# Altium project MotorDriverBoard.PrjPcb
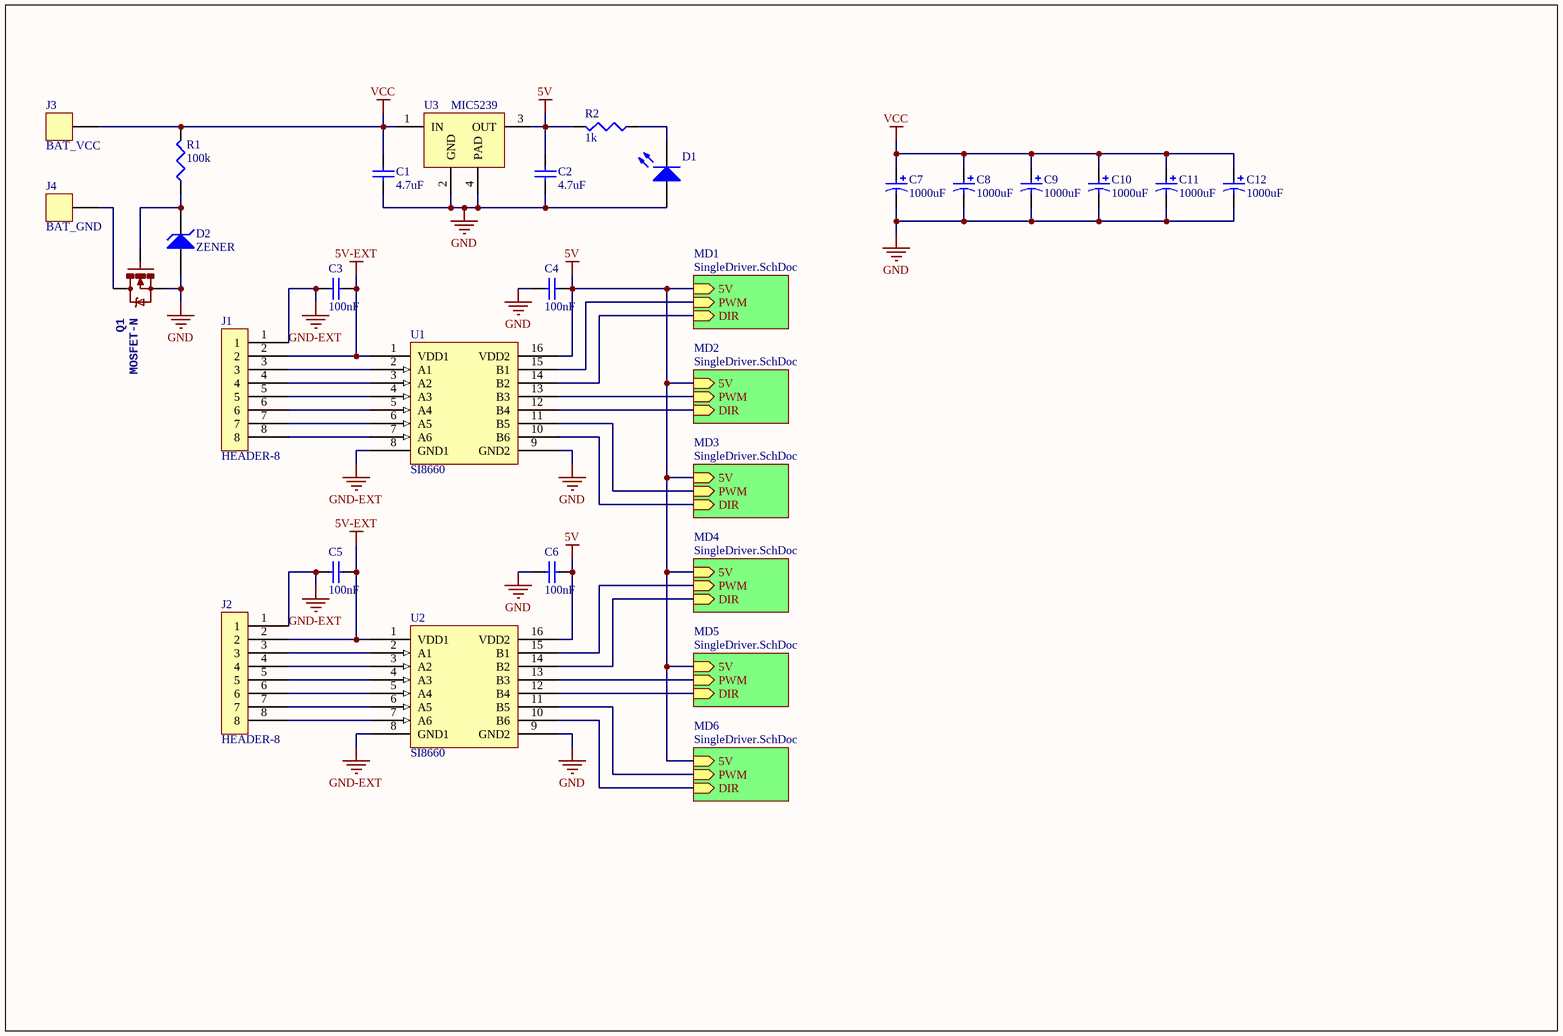
[diagram p0: MotorDrivers.SchDoc]
2 sheets, 192 parts. Net scope: hierarchical (ports join the sheet entries above them; power ports are global).
Board file: MotorDriverBoard.PcbDoc
Sheets:
  MotorDrivers.SchDoc
    MD1 = SingleDriver.SchDoc
    MD2 = SingleDriver.SchDoc
    MD3 = SingleDriver.SchDoc
    MD4 = SingleDriver.SchDoc
    MD5 = SingleDriver.SchDoc
    MD6 = SingleDriver.SchDoc

## Sheet MotorDrivers.SchDoc
size A4

### Parts
C1  4.7uF  [C1206]
C2  4.7uF  [C1206]
C3  100nF  [1608[0603]]
C4  100nF  [1608[0603]]
C5  100nF  [1608[0603]]
C6  100nF  [1608[0603]]
C7  1000uF  [cap_radial_20]
C8  1000uF  [cap_radial_20]
C9  1000uF  [cap_radial_20]
C10  1000uF  [cap_radial_20]
C11  1000uF  [cap_radial_20]
C12  1000uF  [cap_radial_20]
D1  LED2  [1608[0603]]  (value not drawn)
D2  ZENER  [SODFL370X135-2N]
J1  HEADER-8  [MICRO-MATCH-8]
J2  HEADER-8  [MICRO-MATCH-8]
J3  BAT_VCC  [HIGH-POWER-VIA]
J4  BAT_GND  [HIGH-POWER-VIA]
Q1  MOSFET-N  [SOT669]
R1  100k  [J1-0603]
R2  1k  [J1-0603]
U1  SI8660  [SOIC16]
U2  SI8660  [SOIC16]
U3  MIC5239  [SOT230P700X180-4N]

### Sub-sheets
MD1 = SingleDriver.SchDoc: 5V (in), PWM (in), DIR (in)
MD2 = SingleDriver.SchDoc: 5V (in), PWM (in), DIR (in)
MD3 = SingleDriver.SchDoc: 5V (in), PWM (in), DIR (in)
MD4 = SingleDriver.SchDoc: 5V (in), PWM (in), DIR (in)
MD5 = SingleDriver.SchDoc: 5V (in), PWM (in), DIR (in)
MD6 = SingleDriver.SchDoc: 5V (in), PWM (in), DIR (in)

### Nets
5V: C2.2 C4.1 C6.1 R2.2 U1.16(VDD2) U2.16(VDD2) U3.3(OUT) ; sheet MD1/5V, sheet MD2/5V, sheet MD3/5V, sheet MD4/5V, sheet MD5/5V, sheet MD6/5V
5V-EXT: C3.1 C5.1 J1.2 J2.2 U1.1(VDD1) U2.1(VDD1)
GND: C1.1 C2.1 C4.2 C6.2 C7.1 C8.1 C9.1 C10.1 C11.1 C12.1 D1.1(A) D2.2 Q1.S U1.9(GND2) U2.9(GND2) U3.2(GND) U3.4(PAD)
GND-EXT: C3.2 C5.2 J1.1 J2.1 U1.8(GND1) U2.8(GND1)
VCC: C1.2 C7.2 C8.2 C9.2 C10.2 C11.2 C12.2 J3.1 R1.2 U3.1(IN)
NetD1_2: D1.2(K) R2.1
NetD2_1: D2.1 Q1.G R1.1
NetJ1_3: J1.3 U1.2(A1)
NetJ1_4: J1.4 U1.3(A2)
NetJ1_5: J1.5 U1.4(A3)
NetJ1_6: J1.6 U1.5(A4)
NetJ1_7: J1.7 U1.6(A5)
NetJ1_8: J1.8 U1.7(A6)
NetJ2_3: J2.3 U2.2(A1)
NetJ2_4: J2.4 U2.3(A2)
NetJ2_5: J2.5 U2.4(A3)
NetJ2_6: J2.6 U2.5(A4)
NetJ2_7: J2.7 U2.6(A5)
NetJ2_8: J2.8 U2.7(A6)
NetJ4_1: J4.1 Q1.D
NetU1_10: U1.10(B6) ; sheet MD3/DIR
NetU1_11: U1.11(B5) ; sheet MD3/PWM
NetU1_12: U1.12(B4) ; sheet MD2/DIR
NetU1_13: U1.13(B3) ; sheet MD2/PWM
NetU1_14: U1.14(B2) ; sheet MD1/DIR
NetU1_15: U1.15(B1) ; sheet MD1/PWM
NetU1_MD4_19: U2.14(B2) ; sheet MD4/DIR
NetU1_MD4_22: U2.15(B1) ; sheet MD4/PWM
NetU1_MD5_19: U2.12(B4) ; sheet MD5/DIR
NetU1_MD5_22: U2.13(B3) ; sheet MD5/PWM
NetU1_MD6_19: U2.10(B6) ; sheet MD6/DIR
NetU1_MD6_22: U2.11(B5) ; sheet MD6/PWM

### Library data of the parts
C1-C6 = Cap Semi: Capacitor (Semiconductor SIM Model); Value: 100pF; Published: 8-Jun-2000; LatestRevisionDate: 29-May-2009; LatestRevisionNote: IPC-7351 Footprint Added.; PackageReference: C1206; Publisher: Altium Limited; PackageDescription: Chip Capacitor
C7-C12 = cap_pol
D1 = LED2: Typical RED, GREEN, YELLOW, AMBER GaAs LED; Published: 8-Jun-2000; LatestRevisionDate: 17-Jul-2002; LatestRevisionNote: Re-released for DXP Platform.; PackageVersion: Feb-2002; PackageReference: 3.2X1.6X1.1; Publisher: Altium Limited; PackageDescription: SM LED; 2 Flat Leads
D2 = ZENER-DIODE
J3 J4 = HEADER-1
Q1 = MOSFET-N: PROD_ID: IC-08089
R1 = Res3: Resistor; Value: 1K; Published: 8-Jun-2000; LatestRevisionDate: 29-May-2009; LatestRevisionNote: IPC-7351 Footprint Added.; PackageReference: J1-0603; Publisher: Altium Limited; PackageDescription: Chip Resistor
R2 = Res3: Resistor; Published: 8-Jun-2000; LatestRevisionDate: 29-May-2009; LatestRevisionNote: IPC-7351 Footprint Added.; PackageReference: J1-0603; Publisher: Altium Limited; PackageDescription: Chip Resistor; Value: 1K

## Sheet SingleDriver.SchDoc
size A4
Used 6 times, as channels MD1, MD2, MD3, MD4, MD5, MD6. Parts and nets are listed once, with the designators drawn on the sheet.
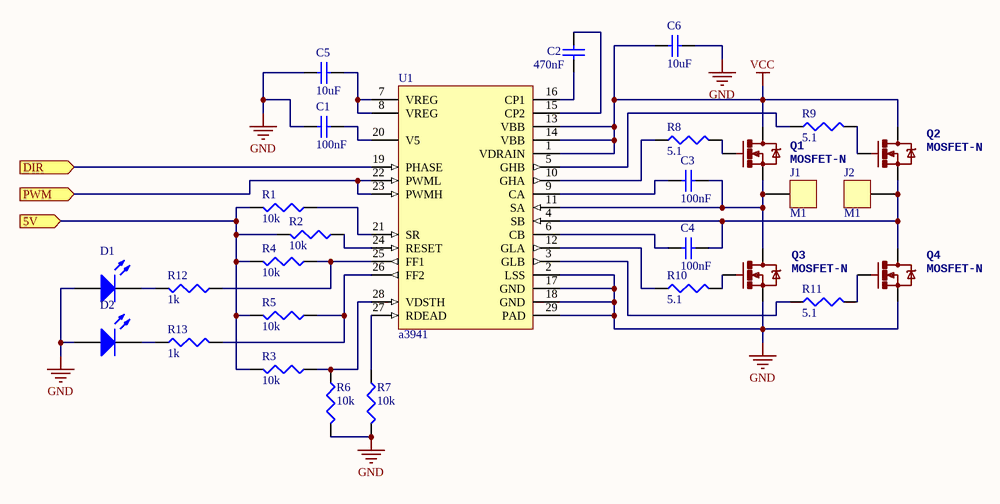
[diagram p1: SingleDriver.SchDoc]

### Parts
C1  100nF  [1608[0603]]
C2  470nF  [1608[0603]]
C3  100nF  [1608[0603]]
C4  100nF  [1608[0603]]
C5  10uF  [C1206]
C6  10uF  [C1206]
D1  LED2  [1608[0603]]  (value not drawn)
D2  LED2  [1608[0603]]  (value not drawn)
J1  M1  [POWER-VIA]
J2  M1  [POWER-VIA]
Q1  MOSFET-N  [SOT669]
Q2  MOSFET-N  [SOT669]
Q3  MOSFET-N  [SOT669]
Q4  MOSFET-N  [SOT669]
R1  10k  [J1-0603]
R2  10k  [J1-0603]
R3  10k  [J1-0603]
R4  10k  [J1-0603]
R5  10k  [J1-0603]
R6  10k  [J1-0603]
R7  10k  [J1-0603]
R8  5.1  [J1-0603]
R9  5.1  [J1-0603]
R10  5.1  [J1-0603]
R11  5.1  [J1-0603]
R12  1k  [J1-0603]
R13  1k  [J1-0603]
U1  a3941  [TSSOP28]

### Ports
5V (in), DIR (in), PWM (in)

### Nets
GND: C1.1 C5.1 C6.2 D1.1(A) D2.1(A) Q3.S Q4.S R6.2 R7.2 U1.2(LSS) U1.17(GND) U1.18(GND) U1.29(PAD)
VCC: C6.1 Q1.D Q2.D U1.1(VDRAIN) U1.13(VBB) U1.14(VBB)
5V: R1.2 R2.2 R3.2 R4.2 R5.2 ; port 5V
DIR: U1.19(PHASE) ; port DIR
PWM: U1.22(PWML) U1.23(PWMH) ; port PWM
NetC1_2: C1.2 U1.20(V5)
NetC2_1: C2.1 U1.16(CP1)
NetC2_2: C2.2 U1.15(CP2)
NetC3_1: C3.1 U1.9(CA)
NetC3_2: C3.2 J1.1 Q1.S Q3.D U1.11(SA)
NetC4_1: C4.1 U1.6(CB)
NetC4_2: C4.2 J2.1 Q2.S Q4.D U1.4(SB)
NetC5_2: C5.2 U1.7(VREG) U1.8(VREG)
NetD1_2: D1.2(K) R12.2
NetD2_2: D2.2(K) R13.1
NetQ1_G: Q1.G R8.2
NetQ2_G: Q2.G R9.2
NetQ3_G: Q3.G R10.2
NetQ4_G: Q4.G R11.2
NetR1_1: R1.1 U1.21(SR)
NetR2_1: R2.1 U1.24(RESET)
NetR3_1: R3.1 R6.1 U1.28(VDSTH)
NetR4_1: R4.1 R12.1 U1.25(FF1)
NetR5_1: R5.1 R13.2 U1.26(FF2)
NetR7_1: R7.1 U1.27(RDEAD)
NetR8_1: R8.1 U1.10(GHA)
NetR9_1: R9.1 U1.5(GHB)
NetR10_1: R10.1 U1.12(GLA)
NetR11_1: R11.1 U1.3(GLB)

### Channels
MD1: designators end in _MD1; ports 5V=5V DIR=NetU1_14 PWM=NetU1_15
MD2: designators end in _MD2; ports 5V=5V DIR=NetU1_12 PWM=NetU1_13
MD3: designators end in _MD3; ports 5V=5V DIR=NetU1_10 PWM=NetU1_11
MD4: designators end in _MD4; ports 5V=5V DIR=NetU1_MD4_19 PWM=NetU1_MD4_22
MD5: designators end in _MD5; ports 5V=5V DIR=NetU1_MD5_19 PWM=NetU1_MD5_22
MD6: designators end in _MD6; ports 5V=5V DIR=NetU1_MD6_19 PWM=NetU1_MD6_22

### Library data of the parts
C1-C6 = Cap Semi: as C1 on sheet MotorDrivers; Published: 8-Jun-2000; LatestRevisionDate: 29-May-2009; LatestRevisionNote: IPC-7351 Footprint Added.; PackageReference: C1206; Publisher: Altium Limited; PackageDescription: Chip Capacitor
D1 D2 = LED2: as D1 on sheet MotorDrivers; Published: 8-Jun-2000; LatestRevisionDate: 17-Jul-2002; LatestRevisionNote: Re-released for DXP Platform.; PackageVersion: Feb-2002; PackageReference: 3.2X1.6X1.1; Publisher: Altium Limited; PackageDescription: SM LED; 2 Flat Leads
J1 J2 = HEADER-1
Q1-Q4 = MOSFET-N: PROD_ID: IC-08089
R1-R11 = Res3: Resistor; Value: 1K; Published: 8-Jun-2000; LatestRevisionDate: 29-May-2009; LatestRevisionNote: IPC-7351 Footprint Added.; PackageReference: J1-0603; Publisher: Altium Limited; PackageDescription: Chip Resistor
R12 R13 = Res3: Resistor; Published: 8-Jun-2000; LatestRevisionDate: 29-May-2009; LatestRevisionNote: IPC-7351 Footprint Added.; PackageReference: J1-0603; Publisher: Altium Limited; PackageDescription: Chip Resistor; Value: 1K

## Nets that join several sheets
5V: MotorDrivers (7 pins), MD1 (5 pins), MD2 (5 pins), MD3 (5 pins), MD4 (5 pins), MD5 (5 pins), MD6 (5 pins)
GND: MotorDrivers (17 pins), MD1 (13 pins), MD2 (13 pins), MD3 (13 pins), MD4 (13 pins), MD5 (13 pins), MD6 (13 pins)
VCC: MotorDrivers (10 pins), MD1 (6 pins), MD2 (6 pins), MD3 (6 pins), MD4 (6 pins), MD5 (6 pins), MD6 (6 pins)
NetU1_10: MotorDrivers (U1.10), MD3 (U1_MD3.19)
NetU1_11: MotorDrivers (U1.11), MD3 (U1_MD3.22 U1_MD3.23)
NetU1_12: MotorDrivers (U1.12), MD2 (U1_MD2.19)
NetU1_13: MotorDrivers (U1.13), MD2 (U1_MD2.22 U1_MD2.23)
NetU1_14: MotorDrivers (U1.14), MD1 (U1_MD1.19)
NetU1_15: MotorDrivers (U1.15), MD1 (U1_MD1.22 U1_MD1.23)
NetU1_MD4_19: MotorDrivers (U2.14), MD4 (U1_MD4.19)
NetU1_MD4_22: MotorDrivers (U2.15), MD4 (U1_MD4.22 U1_MD4.23)
NetU1_MD5_19: MotorDrivers (U2.12), MD5 (U1_MD5.19)
NetU1_MD5_22: MotorDrivers (U2.13), MD5 (U1_MD5.22 U1_MD5.23)
NetU1_MD6_19: MotorDrivers (U2.10), MD6 (U1_MD6.19)
NetU1_MD6_22: MotorDrivers (U2.11), MD6 (U1_MD6.22 U1_MD6.23)